# Altium schematic sheet motordriver-v5.0_power-stage.SchDoc
size A4; SheetNumber: 4; SheetTotal: 7
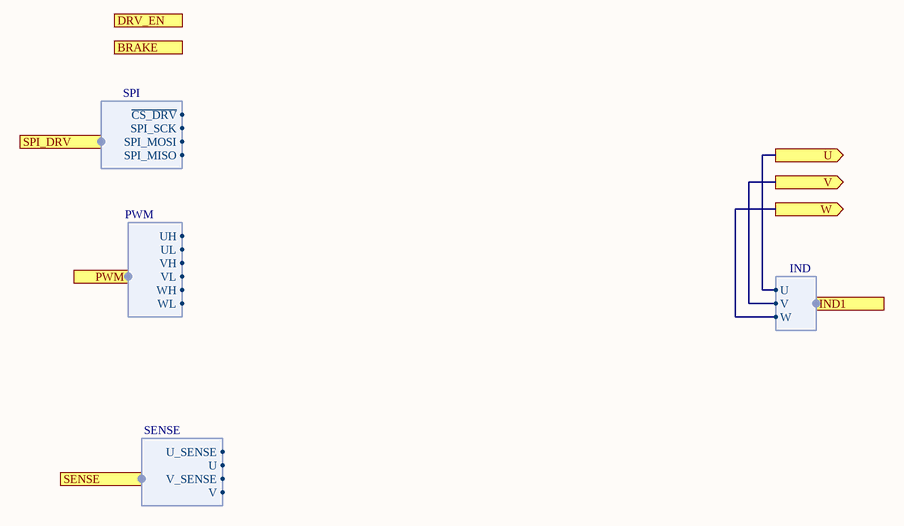
[diagram p0: motordriver-v5.0_power-stage.SchDoc]

## Ports
BRAKE (in), DRV_EN (in), IND1 (harness IND), PWM (harness PWM), SENSE (harness SENSE), SPI_DRV (harness SPI), U (out), V (out), W (out)

## Harnesses
SENSE: U_SENSE, U, V_SENSE, V
SPI: ~{CS_DRV}, SPI_SCK, SPI_MOSI, SPI_MISO
PWM: UH, UL, VH, VL, WH, WL
IND: U, V, W

## Nets
U: port U, port IND1.U
V: port V, port IND1.V
W: port W, port IND1.W